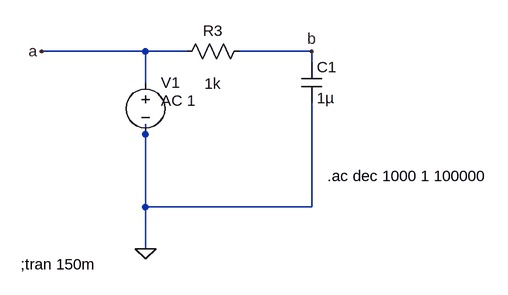
[diagram p0: schematic Circuito-RC-Alterna-Filtro.asc]
Circuito-RC-Alterna-Filtro.asc, the LTspice schematic file:
Version 4
SHEET 1 988 680
WIRE 368 -384 208 -384
WIRE 432 -384 368 -384
WIRE 624 -384 512 -384
WIRE 624 -368 624 -384
WIRE 368 -336 368 -384
WIRE 368 -256 368 -272
WIRE 368 -144 368 -256
WIRE 624 -144 624 -304
WIRE 624 -144 368 -144
WIRE 368 -80 368 -144
FLAG 368 -80 0
FLAG 208 -384 a
FLAG 624 -384 b
DATAFLAG 544 -384 ""
SYMBOL res 416 -368 R270
WINDOW 0 32 56 VTop 2
WINDOW 3 -18 56 VBottom 2
SYMATTR InstName R3
SYMATTR Value 1k
SYMBOL cap 608 -368 R0
SYMATTR InstName C1
SYMATTR Value 1µ
SYMBOL voltage 368 -352 R0
WINDOW 3 24 44 Left 2
WINDOW 123 24 44 Left 2
WINDOW 39 0 0 Left 0
SYMATTR Value ""
SYMATTR Value2 AC 1
SYMATTR InstName V1
TEXT 176 -56 Left 2 !;tran 150m
TEXT 648 -192 Left 2 !.ac dec 1000 1 100000

The netlist it stands for:
* Circuito-RC-Alterna-Filtro.asc
R3 a b 1k
C1 b 0 1µ
V1 a 0 AC 1
;tran 150m
.ac dec 1000 1 100000
.backanno
.end